# EasyEDA Pro project ProPrj_基于STM32的多功能串口分析仪_2025-03-12.epro, schematic STM32H750VB/H7B0VB核心板

## Sheets
1 SCH_STM32H750VB-CoreBoard
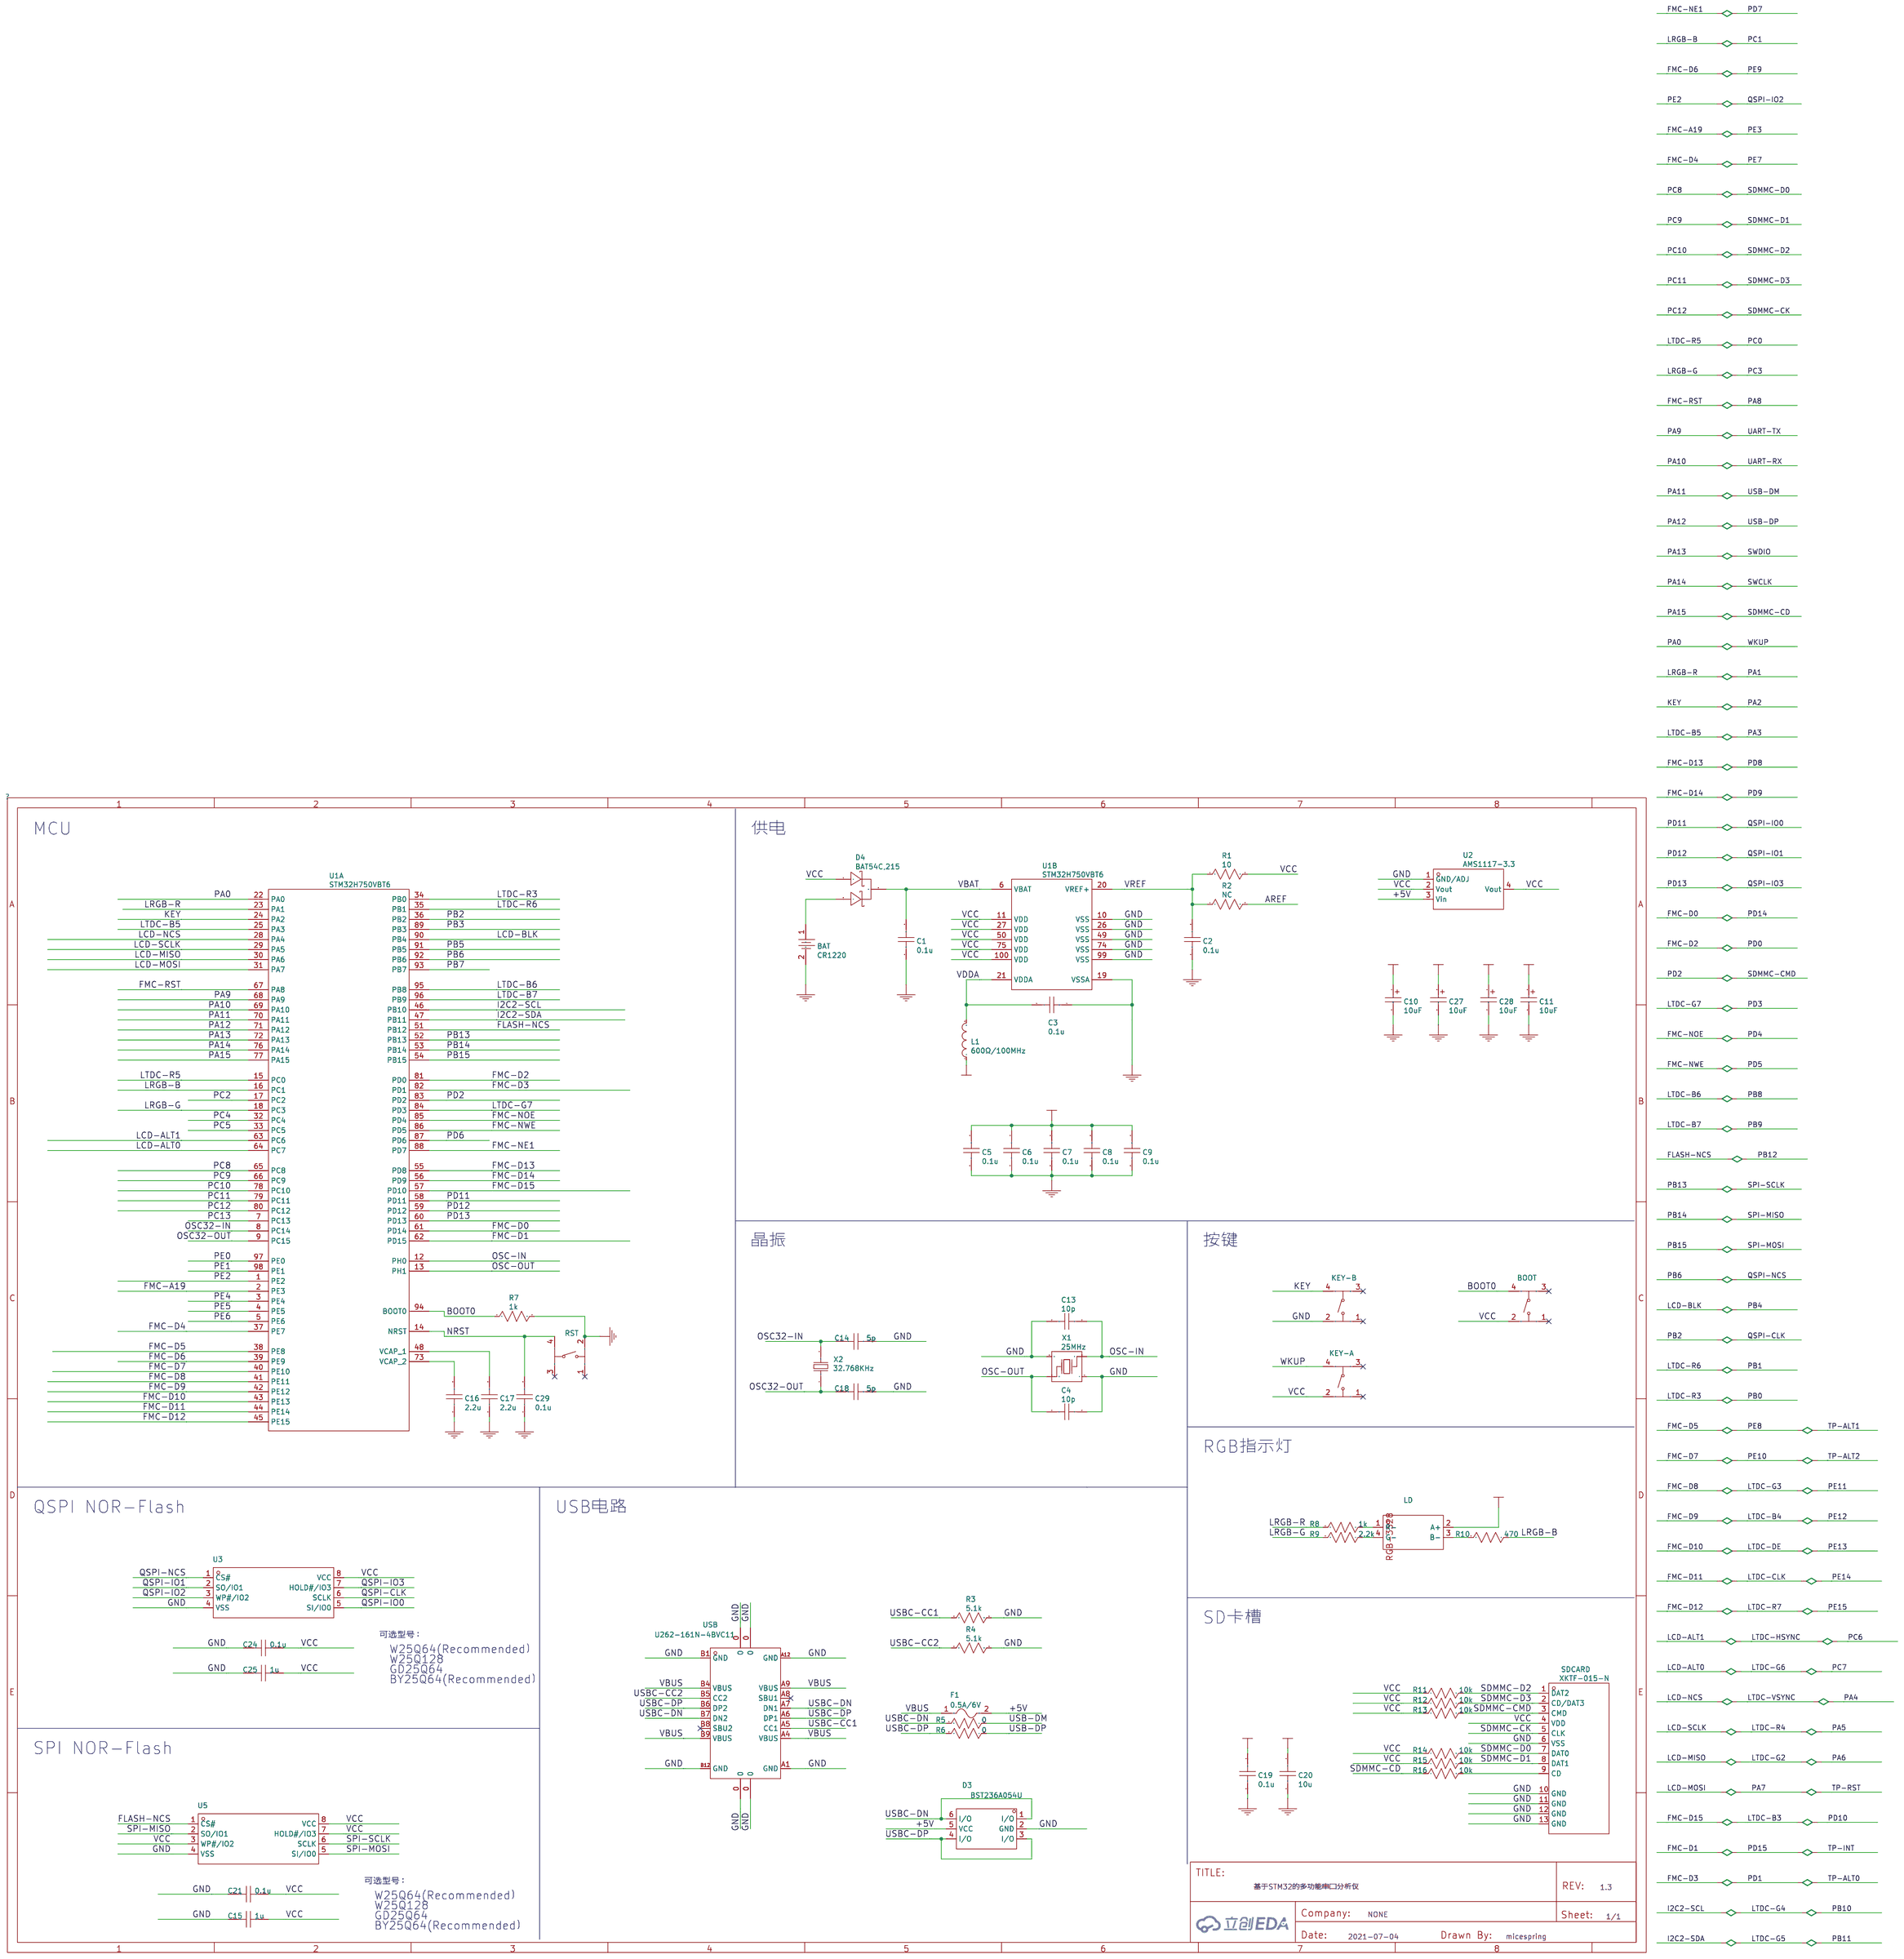
[diagram p9: SCH_STM32H750VB-CoreBoard]
2 SCH_STM32H750VB-CoreBoard-IO
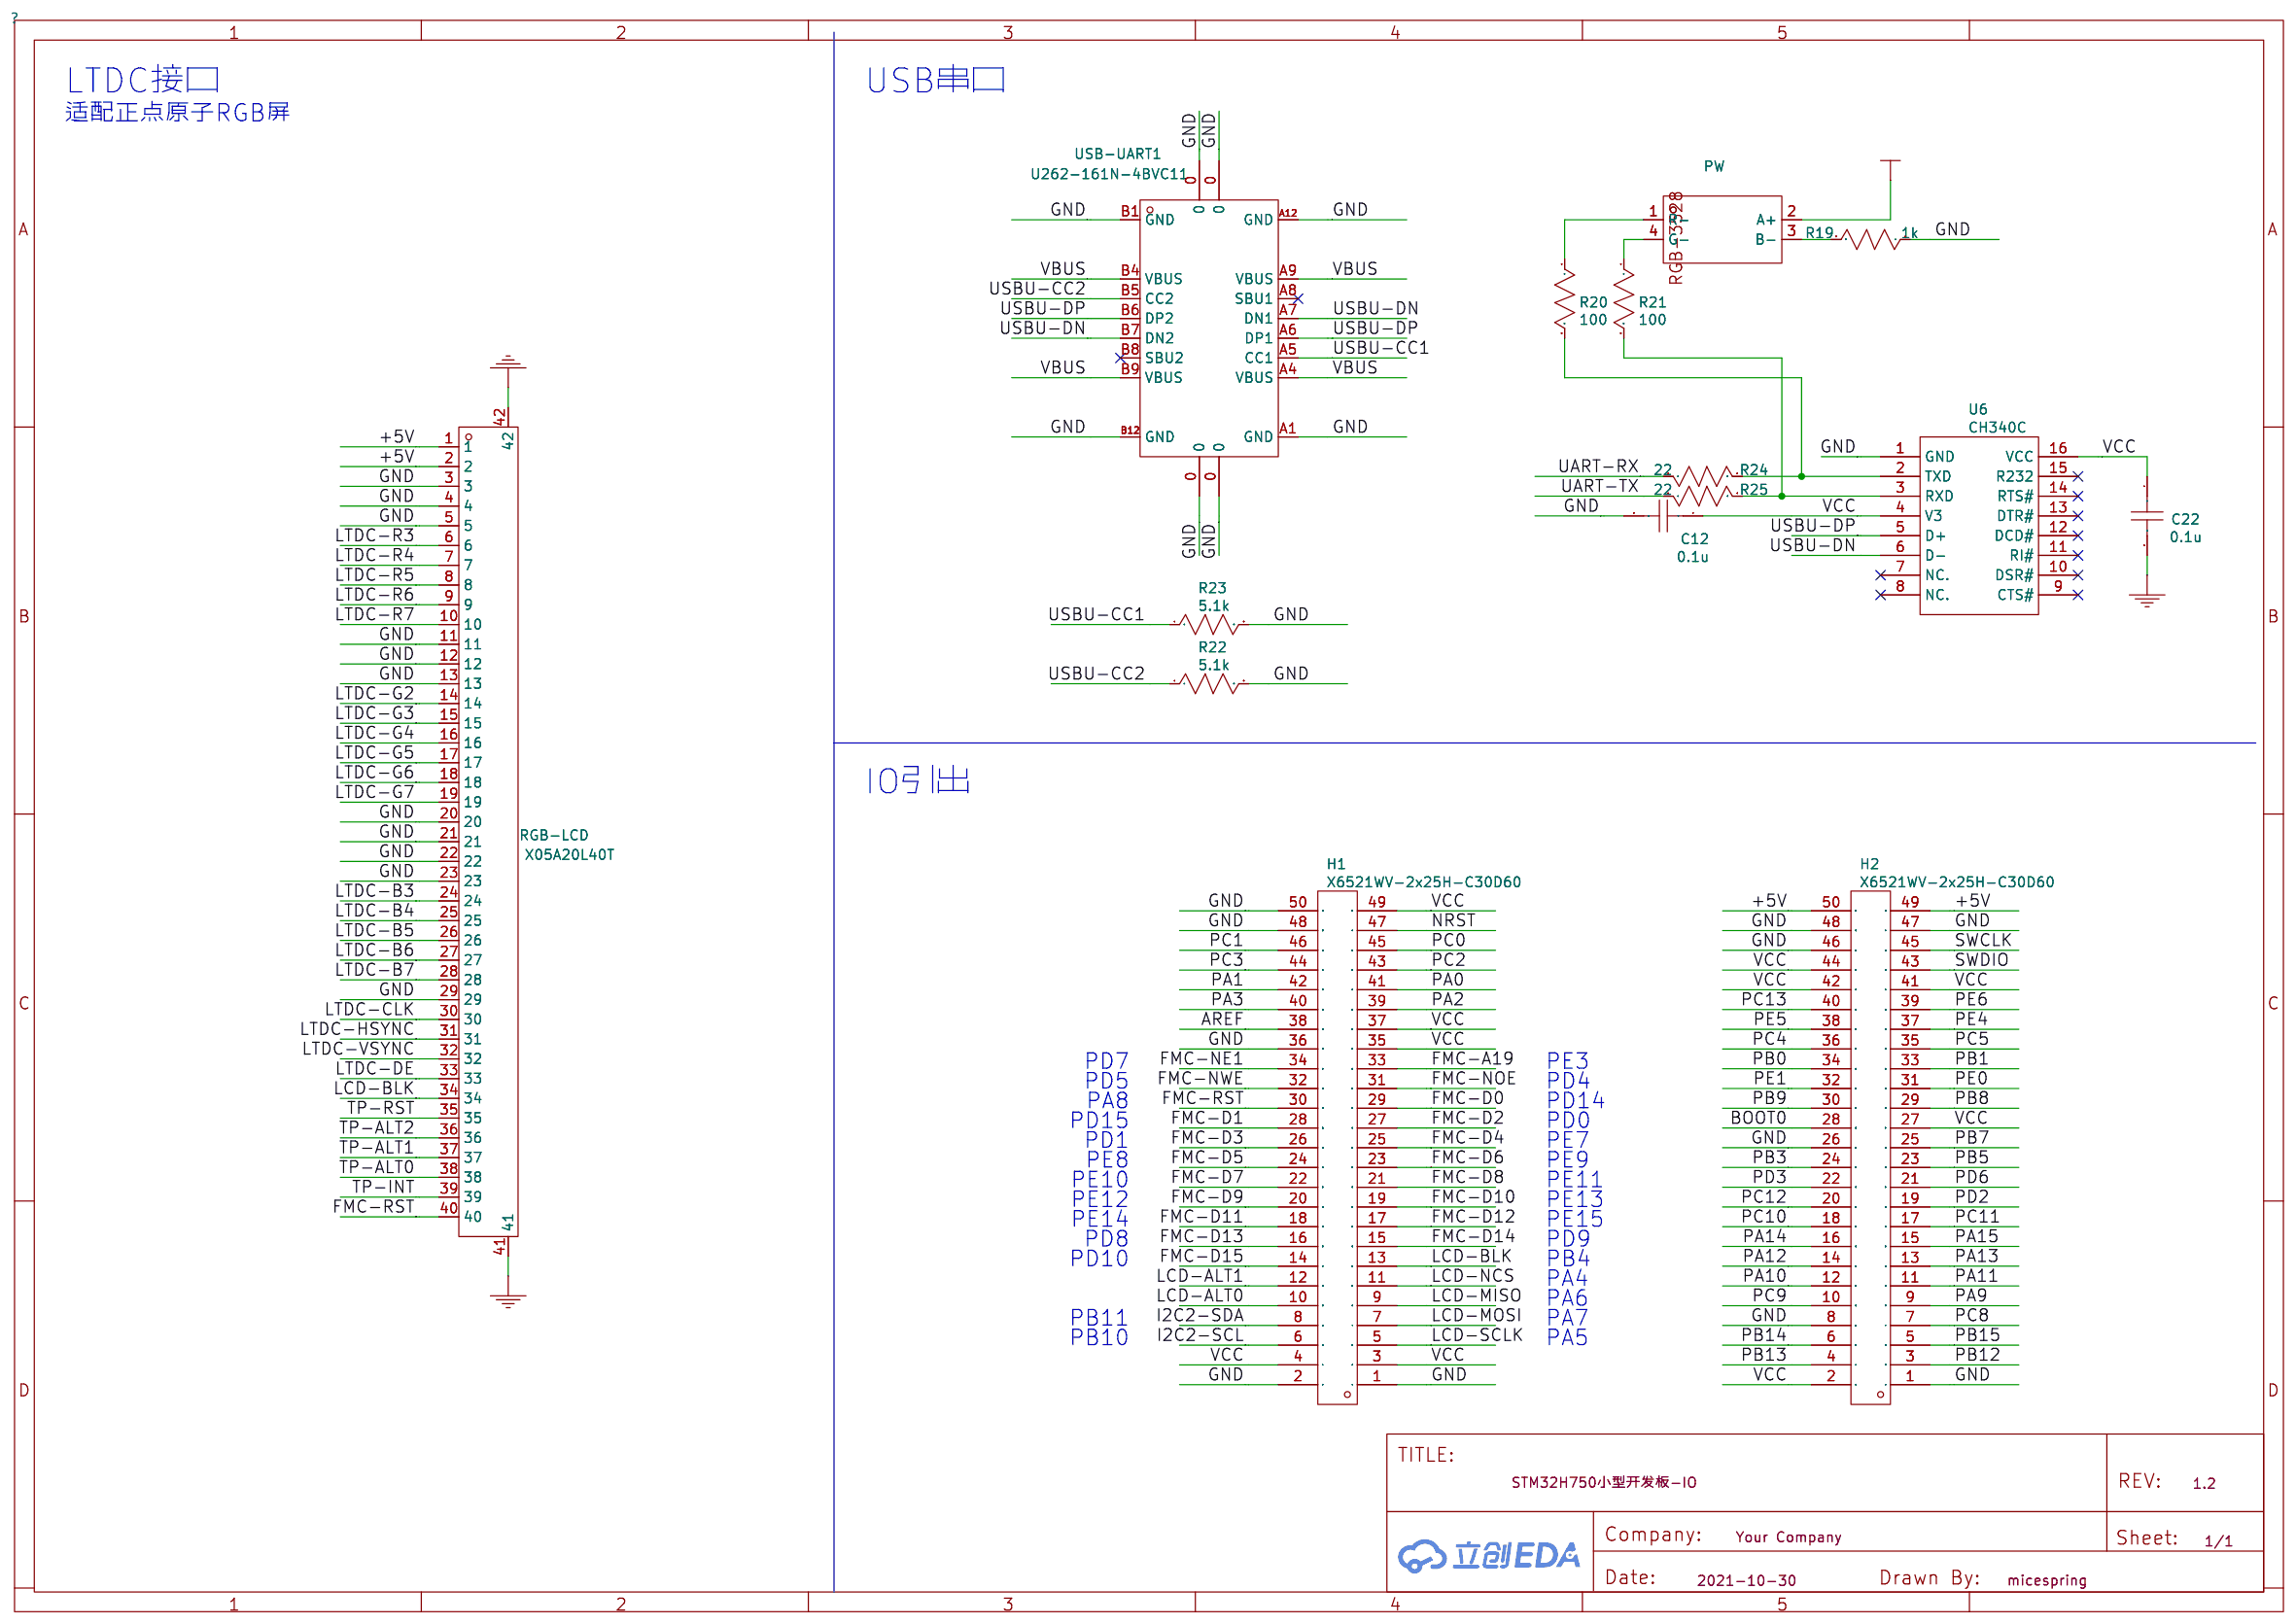
[diagram p10: SCH_STM32H750VB-CoreBoard-IO]

## Parts
sheet SCH_STM32H750VB-CoreBoard-IO
C12  0.1u
C22  0.1u
H1  X6521WV-2x25H-C30D60
H2  X6521WV-2x25H-C30D60
PW  LED-RGB-3528
R19  1k
R20  100
R21  100
R22  5.1k
R23  5.1k
R24  22
R25  22
RGB-LCD  X05A20L40T
U6  CH340C
USB-UART1  U262-161N-4BVC11
sheet SCH_STM32H750VB-CoreBoard
BAT  CR1220
BOOT  TS-1145A-B-A
C1  0.1u
C2  0.1u
C3  0.1u
C4  10p
C5  0.1u
C6  0.1u
C7  0.1u
C8  0.1u
C9  0.1u
C10  10uF
C11  10uF
C13  10p
C14  5p
C15  1u
C16  2.2u
C17  2.2u
C18  5p
C19  0.1u
C20  10u
C21  0.1u
C24  0.1u
C25  1u
C27  10uF
C28  10uF
C29  0.1u
D3  BST236A054U
D4  BAT54C,215
F1  0.5A/6V
KEY-A  TS-1145A-B-A
KEY-B  TS-1145A-B-A
L1  600Ω/100MHz
LD  LED-RGB-3528
R1  10
R2  NC
R3  5.1k
R4  5.1k
R5  0
R6  0
R7  1k
R8  1k
R9  2.2k
R10  470
R11  10k
R12  10k
R13  10k
R14  10k
R15  10k
R16  10k
RST  TS-1145A-B-A
SDCARD  XKTF-015-N
U1  STM32H750VBT6  (sections 1,2)
U2  AMS1117-3.3
U3  GD25Q64CSIGR_C691901
U5  GD25Q64CSIGR_C691901
USB  U262-161N-4BVC11
X1  25MHz
X2  32.768KHz

## Library data of the parts
C1-C3 C5-C9 C12 C19 C21 C22 C24 C29 = 0.1u
H1 H2 = X6521WV-2x25H-C30D60: Supplier: LCSC; Supplier Part: C725897; Manufacturer: XKB Connectivity(中国星坤)
PW R19-R21 R24 R25 = ?
R3 R4 R22 R23 = 5.1k
RGB-LCD = X05A20L40T: Supplier: LCSC; Supplier Part: C388677; Manufacturer: XKB Enterprise
U6 = CH340C: Supplier: LCSC; Manufacturer: WCH; Supplier Part: C84681; JLCPCB Part Class: Extended Part
USB USB-UART1 = U262-161N-4BVC11: Supplier: LCSC; Supplier Part: C319148; Manufacturer: XKB Connectivity(中国星坤)
BAT = CR1220: Supplier: LCSC; Manufacturer: Q&amp;J; Manufacturer Part: CR1220-2; image: //image.lceda.cn/szlcsc/C70381.jpg; Supplier Part: C70381
BOOT KEY-A KEY-B RST = TS-1145A-B-A: Supplier: LCSC; Supplier Part: C318904; Manufacturer: XKB Enterprise
C4 C13 = 10p
C10 C11 C27 C28 = 10uF: Supplier: LCSC; Manufacturer: AVX; Manufacturer Part: TAJA106M016RNJ; Supplier Part: C8015; JLCPCB Part Class: Extend
C14 C18 = 5p
C15 C25 = 1u
C16 C17 = 2.2u
C20 = 10u
D3 = BST236A054U: Supplier: LCSC; Supplier Part: C406203; Manufacturer: Bourne Semicon (Shenzhen); JLCPCB Part Class: Extend
D4 = BAT54C,215: Supplier: LCSC; Manufacturer: Nexperia; image: //image.lceda.cn/szlcsc/C37704.jpg; Supplier Part: C37704; Paste Type: expand
F1 = 0.5A/6V: Supplier: LCSC; Manufacturer: Yenji; Manufacturer Part: SMD0805P050TF; Supplier Part: C130286
L1 = 600Ω/100MHz: Supplier: LCSC; Supplier Part: C216152; Manufacturer: Sunltech(韩国顺磁); Manufacturer Part: SBH2012S601NSP; JLCPCB Part Class: Extended Part
LD = LED-RGB-3528: Manufacturer Part: ?
R1 = 10
R2 = NC
R5 R6 = 0: Manufacturer Part: ?
R7 R8 = 1k: Manufacturer Part: ?
R9 = 2.2k: Manufacturer Part: ?
R10 = 470: Manufacturer Part: ?
R11-R16 = 10k
SDCARD = XKTF-015-N: Supplier: LCSC; Supplier Part: C381082; Manufacturer: XKB Enterprise
U1 = STM32H750VBT6: Supplier Part: C117815; Supplier: LCSC; Manufacturer: STMicroelectronics; Manufacturer Part: STM32F427VGT6
U2 = AMS1117-3.3: Supplier: LCSC; Manufacturer: AMS; image: //image.lceda.cn/szlcsc/C6186.jpg; Supplier Part: C6186; JLCPCB Part Class: Basic
U3 U5 = GD25Q64CSIGR_C691901: Supplier: LCSC; Supplier Part: C691901; Manufacturer: GigaDevice Semicon Beijing; Manufacturer Part: STM32F103CBT6
X1 = 25MHz: Supplier: LCSC; Supplier Part: C400090; Manufacturer: Zhejiang Abel Elec; Manufacturer Part: TAXM8M4RDBCCT2T; JLCPCB Part Class: Extend
X2 = 32.768KHz: Supplier: LCSC; Manufacturer Part: Q13FC1350000400; Manufacturer: EPSON; Supplier Part: C32346; JLCPCB Part Class: Basic; JLCPCB SMD: Yes

## Nets
+5V: C10.1 C27.1 D3.5(VCC) F1.2 H2.49 H2.50 RGB-LCD.1 RGB-LCD.2 U2.3(Vin)
GND: BAT.2 C1.1 C2.1 C3.1 C4.2 C5.2 C6.2 C7.2 C8.2 C9.2 C10.2 C11.2 C12.2 C13.1 C14.1 C15.1 C16.1 C17.1 C18.1 C19.2 C20.2 C21.1 C22.2 C24.1 C25.1 C27.2 C28.2 C29.1 D3.2(GND) H1.1 H1.2 H1.36 H1.48 H1.50 H2.1 H2.8 H2.26 H2.46 H2.47 H2.48 KEY-B.2 R3.2 R4.2 R7.2 R19.1 R22.2 R23.2 RGB-LCD.3 RGB-LCD.4 RGB-LCD.5 RGB-LCD.11 RGB-LCD.12 RGB-LCD.13 RGB-LCD.20 RGB-LCD.21 RGB-LCD.22 RGB-LCD.23 RGB-LCD.29 RGB-LCD.41 RGB-LCD.42 RST.2 SDCARD.6(VSS) SDCARD.10(GND) SDCARD.11(GND) SDCARD.12(GND) SDCARD.13(GND) U1.10(VSS) U1.19(VSSA) U1.26(VSS) U1.49(VSS) U1.74(VSS) U1.99(VSS) U2.1(GND/ADJ) U3.4(VSS) U5.4(VSS) U6.1(GND) USB.0 USB.A1(GND) USB.A12(GND) USB.B1(GND) USB.B12(GND) USB-UART1.0 USB-UART1.A1(GND) USB-UART1.A12(GND) USB-UART1.B1(GND) USB-UART1.B12(GND) X1.2 X1.4
VBAT: C1.2 D4.3(K) U1.6(VBAT)
VBUS: F1.1 USB.A4(VBUS) USB.A9(VBUS) USB.B4(VBUS) USB.B9(VBUS) USB-UART1.A4(VBUS) USB-UART1.A9(VBUS) USB-UART1.B4(VBUS) USB-UART1.B9(VBUS)
VCC: BOOT.2 C5.1 C6.1 C7.1 C8.1 C9.1 C11.1 C12.1 C15.2 C19.1 C20.1 C21.2 C22.1 C24.2 C25.2 C28.1 D4.1(A) H1.3 H1.4 H1.35 H1.37 H1.49 H2.2 H2.27 H2.41 H2.42 H2.44 KEY-A.2 L1.1 LD.2(A+) PW.2(A+) R1.2 R11.1 R12.1 R13.1 R14.1 R15.1 SDCARD.4(VDD) U1.11(VDD) U1.27(VDD) U1.50(VDD) U1.75(VDD) U1.100(VDD) U2.2(Vout) U2.4(Vout) U3.8(VCC) U5.3(WP#/IO2) U5.7(HOLD#/IO3) U5.8(VCC) U6.4(V3) U6.16(VCC)
VDDA: C3.2 L1.2 U1.21(VDDA)
AREF: H1.38 R2.2
BOOT0: BOOT.4 H2.28 R7.1 U1.94(BOOT0)
FLASH-NCS: H2.3 U1.51(PB12) U5.1(CS#)
FMC-A19: H1.33 U1.2(PE3)
FMC-D0: H1.29 U1.61(PD14)
FMC-D1: H1.28 RGB-LCD.39 U1.62(PD15)
FMC-D2: H1.27 U1.81(PD0)
FMC-D3: H1.26 RGB-LCD.38 U1.82(PD1)
FMC-D4: H1.25 U1.37(PE7)
FMC-D5: H1.24 RGB-LCD.37 U1.38(PE8)
FMC-D6: H1.23 U1.39(PE9)
FMC-D7: H1.22 RGB-LCD.36 U1.40(PE10)
FMC-D8: H1.21 RGB-LCD.15 U1.41(PE11)
FMC-D9: H1.20 RGB-LCD.25 U1.42(PE12)
FMC-D10: H1.19 RGB-LCD.33 U1.43(PE13)
FMC-D11: H1.18 RGB-LCD.30 U1.44(PE14)
FMC-D12: H1.17 RGB-LCD.10 U1.45(PE15)
FMC-D13: H1.16 U1.55(PD8)
FMC-D14: H1.15 U1.56(PD9)
FMC-D15: H1.14 RGB-LCD.24 U1.57(PD10)
FMC-NE1: H1.34 U1.88(PD7)
FMC-NOE: H1.31 U1.85(PD4)
FMC-NWE: H1.32 U1.86(PD5)
FMC-RST: H1.30 RGB-LCD.40 U1.67(PA8)
I2C2-SCL: H1.6 RGB-LCD.16 U1.46(PB10)
I2C2-SDA: H1.8 RGB-LCD.17 U1.47(PB11)
KEY: H1.39 KEY-B.4 U1.24(PA2)
LCD-ALT0: H1.10 RGB-LCD.18 U1.64(PC7)
LCD-ALT1: H1.12 RGB-LCD.31 U1.63(PC6)
LCD-BLK: H1.13 RGB-LCD.34 U1.90(PB4)
LCD-MISO: H1.9 RGB-LCD.14 U1.30(PA6)
LCD-MOSI: H1.7 RGB-LCD.35 U1.31(PA7)
LCD-NCS: H1.11 RGB-LCD.32 U1.28(PA4)
LCD-SCLK: H1.5 RGB-LCD.7 U1.29(PA5)
LRGB-B: H1.46 R10.1 U1.16(PC1)
LRGB-G: H1.44 R9.2 U1.18(PC3)
LRGB-R: H1.42 R8.2 U1.23(PA1)
LTDC-B5: H1.40 RGB-LCD.26 U1.25(PA3)
LTDC-B6: H2.29 RGB-LCD.27 U1.95(PB8)
LTDC-B7: H2.30 RGB-LCD.28 U1.96(PB9)
LTDC-G7: H2.22 RGB-LCD.19 U1.84(PD3)
LTDC-R3: H2.34 RGB-LCD.6 U1.34(PB0)
LTDC-R5: H1.45 RGB-LCD.8 U1.15(PC0)
LTDC-R6: H2.33 RGB-LCD.9 U1.35(PB1)
NRST: C29.2 H1.47 RST.4 U1.14(NRST)
OSC32-IN: C14.2 U1.8(PC14) X2.2
OSC32-OUT: C18.2 U1.9(PC15) X2.1
OSC-IN: C13.2 U1.12(PH0) X1.1
OSC-OUT: C4.1 U1.13(PH1) X1.3
PA0: H1.41 KEY-A.4 U1.22(PA0)
PA9: H2.9 R25.1 U1.68(PA9)
PA10: H2.12 R24.1 U1.69(PA10)
PA11: H2.11 R5.1 U1.70(PA11)
PA12: H2.14 R6.1 U1.71(PA12)
PA13: H2.13 H2.43 U1.72(PA13)
PA14: H2.16 H2.45 U1.76(PA14)
PA15: H2.15 R16.1 U1.77(PA15)
PB2: U1.36(PB2) U3.6(SCLK)
PB3: H2.24 U1.89(PB3)
PB5: H2.23 U1.91(PB5)
PB6: U1.92(PB6) U3.1(CS#)
PB7: H2.25 U1.93(PB7)
PB13: H2.4 U1.52(PB13) U5.6(SCLK)
PB14: H2.6 U1.53(PB14) U5.2(SO/IO1)
PB15: H2.5 U1.54(PB15) U5.5(SI/IO0)
PC2: H1.43 U1.17(PC2)
PC4: H2.36 U1.32(PC4)
PC5: H2.35 U1.33(PC5)
PC8: H2.7 R14.2 SDCARD.7(DAT0) U1.65(PC8)
PC9: H2.10 R15.2 SDCARD.8(DAT1) U1.66(PC9)
PC10: H2.18 R11.2 SDCARD.1(DAT2) U1.78(PC10)
PC11: H2.17 R12.2 SDCARD.2(CD/DAT3) U1.79(PC11)
PC12: H2.20 SDCARD.5(CLK) U1.80(PC12)
PC13: H2.40 U1.7(PC13)
PD2: H2.19 R13.2 SDCARD.3(CMD) U1.83(PD2)
PD6: H2.21 U1.87(PD6)
PD11: U1.58(PD11) U3.5(SI/IO0)
PD12: U1.59(PD12) U3.2(SO/IO1)
PD13: U1.60(PD13) U3.7(HOLD#/IO3)
PE0: H2.31 U1.97(PE0)
PE1: H2.32 U1.98(PE1)
PE2: U1.1(PE2) U3.3(WP#/IO2)
PE4: H2.37 U1.3(PE4)
PE5: H2.38 U1.4(PE5)
PE6: H2.39 U1.5(PE6)
USBC-CC1: R3.1 USB.A5(CC1)
USBC-CC2: R4.1 USB.B5(CC2)
USBC-DN: D3.1(I/O) D3.6(I/O) R5.2 USB.A7(DN1) USB.B7(DN2)
USBC-DP: D3.3(I/O) D3.4(I/O) R6.2 USB.A6(DP1) USB.B6(DP2)
USBU-CC1: R23.1 USB-UART1.A5(CC1)
USBU-CC2: R22.1 USB-UART1.B5(CC2)
USBU-DN: U6.6(D-) USB-UART1.A7(DN1) USB-UART1.B7(DN2)
USBU-DP: U6.5(D+) USB-UART1.A6(DP1) USB-UART1.B6(DP2)
VREF: C2.2 R1.1 R2.1 U1.20(VREF+)
Net-(BAT-1): BAT.1 D4.2(A)
Net-(C16-2): C16.2 U1.73(VCAP_2)
Net-(C17-2): C17.2 U1.48(VCAP_1)
Net-(LD-1): LD.1(R-) R8.1
Net-(LD-3): LD.3(B-) R10.2
Net-(LD-4): LD.4(G-) R9.1
Net-(PW-1): PW.1(R-) R20.1
Net-(PW-3): PW.3(B-) R19.2
Net-(PW-4): PW.4(G-) R21.1
Net-(R16-2): R16.2 SDCARD.9(CD)
Net-(R20-2): R20.2 R24.2 U6.2(TXD)
Net-(R21-2): R21.2 R25.2 U6.3(RXD)

Not connected (* = marked no-connect by the designer): BOOT 1* 3*; KEY-A 1* 3*; KEY-B 1* 3*; RST 1* 3*; U6 7(NC.)* 8(NC.)* 9(CTS#)* 10(DSR#)* 11(RI#)* 12(DCD#)* 13(DTR#)* 14(RTS#)* 15(R232)*; USB A8(SBU1)* B8(SBU2)*; USB-UART1 A8(SBU1)* B8(SBU2)*

## Notes on the sheets
sheet 1
- MCU
- 供电
- 晶振
- 按键
- RGB指示灯
- QSPI NOR-Flash
- USB电路
- SD卡槽
- 可选型号：
- W25Q64(Recommended）
- W25Q128
- GD25Q64
- BY25Q64(Recommended）
- SPI NOR-Flash
- 可选型号：
- W25Q64(Recommended）
- GD25Q64
- W25Q128
- BY25Q64(Recommended）
sheet 2
- LTDC接口
- USB串口
- 适配正点原子RGB屏
- IO引出
- PD7
- PE3
- PD5
- PD4
- PA8
- PD14
- PD1
- PD15
- PD0
- PE7
- PE8
- PE9
- PE10
- PE11
- PE12
- PE13
- PE14
- PE15
- PD10
- PD8
- PB4
- PD9
- PA4
- PA6
- PB11
- PA7
- PB10
- PA5
